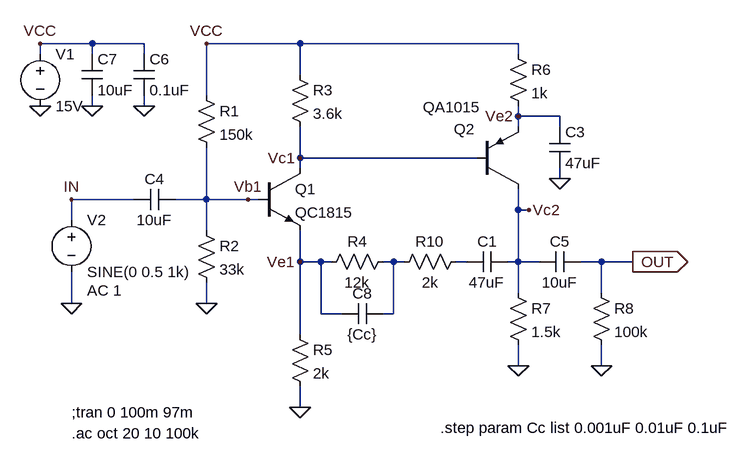
[diagram p0: schematic Negative FeedBack_Low_Boost.asc]
Negative FeedBack_Low_Boost.asc, the LTspice schematic file:
Version 4
SHEET 1 1124 680
WIRE 0 -64 -80 -64
WIRE 80 -64 0 -64
WIRE 320 -64 176 -64
WIRE 656 -64 320 -64
WIRE -80 -48 -80 -64
WIRE 0 -48 0 -64
WIRE 80 -48 80 -64
WIRE 656 -48 656 -64
WIRE 320 -16 320 -64
WIRE 176 16 176 -64
WIRE 0 32 0 16
WIRE 80 32 80 16
WIRE 656 48 656 32
WIRE 720 48 656 48
WIRE 656 64 656 48
WIRE 720 64 720 48
WIRE 320 112 320 64
WIRE 592 112 320 112
WIRE 320 128 320 112
WIRE 720 144 720 128
WIRE 64 176 -32 176
WIRE 176 176 176 96
WIRE 176 176 128 176
WIRE 240 176 176 176
WIRE 256 176 240 176
WIRE 656 192 656 160
WIRE 672 192 656 192
WIRE -32 208 -32 176
WIRE 176 224 176 176
WIRE 320 272 320 224
WIRE 352 272 320 272
WIRE 368 272 352 272
WIRE 464 272 448 272
WIRE 480 272 464 272
WIRE 576 272 560 272
WIRE 656 272 656 192
WIRE 656 272 640 272
WIRE 688 272 656 272
WIRE 784 272 752 272
WIRE 832 272 784 272
WIRE 656 320 656 272
WIRE 784 320 784 272
WIRE -32 336 -32 288
WIRE 176 336 176 304
WIRE 352 352 352 272
WIRE 384 352 352 352
WIRE 464 352 464 272
WIRE 464 352 448 352
WIRE 320 384 320 272
WIRE 656 432 656 400
WIRE 784 432 784 400
WIRE 320 496 320 464
FLAG 320 496 0
FLAG 176 336 0
FLAG 656 432 0
FLAG 176 -64 VCC
FLAG -80 -64 VCC
FLAG -80 32 0
FLAG 784 432 0
FLAG 832 272 OUT
IOPIN 832 272 Out
FLAG -32 336 0
FLAG -32 176 IN
FLAG 240 176 Vb1
FLAG 320 272 Ve1
FLAG 320 112 Vc1
FLAG 672 192 Vc2
FLAG 656 48 Ve2
FLAG 0 32 0
FLAG 80 32 0
FLAG 720 144 0
SYMBOL res 160 0 R0
SYMATTR InstName R1
SYMATTR Value 150k
SYMBOL res 160 208 R0
SYMATTR InstName R2
SYMATTR Value 33k
SYMBOL res 304 -32 R0
SYMATTR InstName R3
SYMATTR Value 3.6k
SYMBOL res 464 256 R90
WINDOW 0 0 56 VBottom 2
WINDOW 3 32 56 VTop 2
SYMATTR InstName R4
SYMATTR Value 12k
SYMBOL res 304 368 R0
SYMATTR InstName R5
SYMATTR Value 2k
SYMBOL cap 640 256 R90
WINDOW 0 0 32 VBottom 2
WINDOW 3 32 32 VTop 2
SYMATTR InstName C1
SYMATTR Value 47uF
SYMBOL res 640 -64 R0
SYMATTR InstName R6
SYMATTR Value 1k
SYMBOL cap 704 64 R0
SYMATTR InstName C3
SYMATTR Value 47uF
SYMBOL res 640 304 R0
SYMATTR InstName R7
SYMATTR Value 1.5k
SYMBOL voltage -80 -64 R0
WINDOW 123 0 0 Left 2
WINDOW 39 0 0 Left 2
SYMATTR InstName V1
SYMATTR Value 15V
SYMBOL cap 128 160 R90
WINDOW 0 0 32 VBottom 2
WINDOW 3 32 32 VTop 2
SYMATTR InstName C4
SYMATTR Value 10uF
SYMBOL cap 752 256 R90
WINDOW 0 0 32 VBottom 2
WINDOW 3 32 32 VTop 2
SYMATTR InstName C5
SYMATTR Value 10uF
SYMBOL res 768 304 R0
SYMATTR InstName R8
SYMATTR Value 100k
SYMBOL voltage -32 192 R0
WINDOW 123 24 124 Left 2
WINDOW 39 0 0 Left 2
SYMATTR Value2 AC 1
SYMATTR InstName V2
SYMATTR Value SINE(0 0.5 1k)
SYMBOL npn 256 128 R0
SYMATTR InstName Q1
SYMATTR Value QC1815
SYMBOL pnp 592 160 M180
WINDOW 0 -35 92 Left 2
WINDOW 3 -83 126 Left 2
SYMATTR InstName Q2
SYMATTR Value QA1015
SYMBOL cap 64 -48 R0
SYMATTR InstName C6
SYMATTR Value 0.1uF
SYMBOL cap -16 -48 R0
SYMATTR InstName C7
SYMATTR Value 10uF
SYMBOL cap 448 336 R90
WINDOW 0 0 32 VBottom 2
WINDOW 3 32 32 VTop 2
SYMATTR InstName C8
SYMATTR Value {Cc}
SYMBOL res 576 256 R90
WINDOW 0 0 56 VBottom 2
WINDOW 3 32 56 VTop 2
SYMATTR InstName R10
SYMATTR Value 2k
TEXT -32 504 Left 2 !;tran 0 100m 97m
TEXT 536 528 Left 2 !.step param Cc list 0.001uF 0.01uF 0.1uF
TEXT -32 536 Left 2 !.ac oct 20 10 100k

The netlist it stands for:
* Negative FeedBack_Low_Boost.asc
R1 VCC Vb1 150k
R2 Vb1 0 33k
R3 VCC Vc1 3.6k
R4 N001 Ve1 12k
R5 Ve1 0 2k
C1 Vc2 N002 47uF
R6 VCC Ve2 1k
C3 Ve2 0 47uF
R7 Vc2 0 1.5k
V1 VCC 0 15V
C4 Vb1 IN 10uF
C5 OUT Vc2 10uF
R8 OUT 0 100k
V2 IN 0 SINE(0 0.5 1k) AC 1
Q1 Vc1 Vb1 Ve1 0 QC1815
Q2 Vc2 Vc1 Ve2 0 QA1015
C6 VCC 0 0.1uF
C7 VCC 0 10uF
C8 N001 Ve1 {Cc}
R10 N002 N001 2k
.model NPN NPN
.model PNP PNP
.lib standard.bjt
;tran 0 100m 97m
.step param Cc list 0.001uF 0.01uF 0.1uF
.ac oct 20 10 100k
.backanno
.end